# Altium schematic sheet STM32.SchDoc
size A4; SheetNumber: 2; SheetTotal: 3
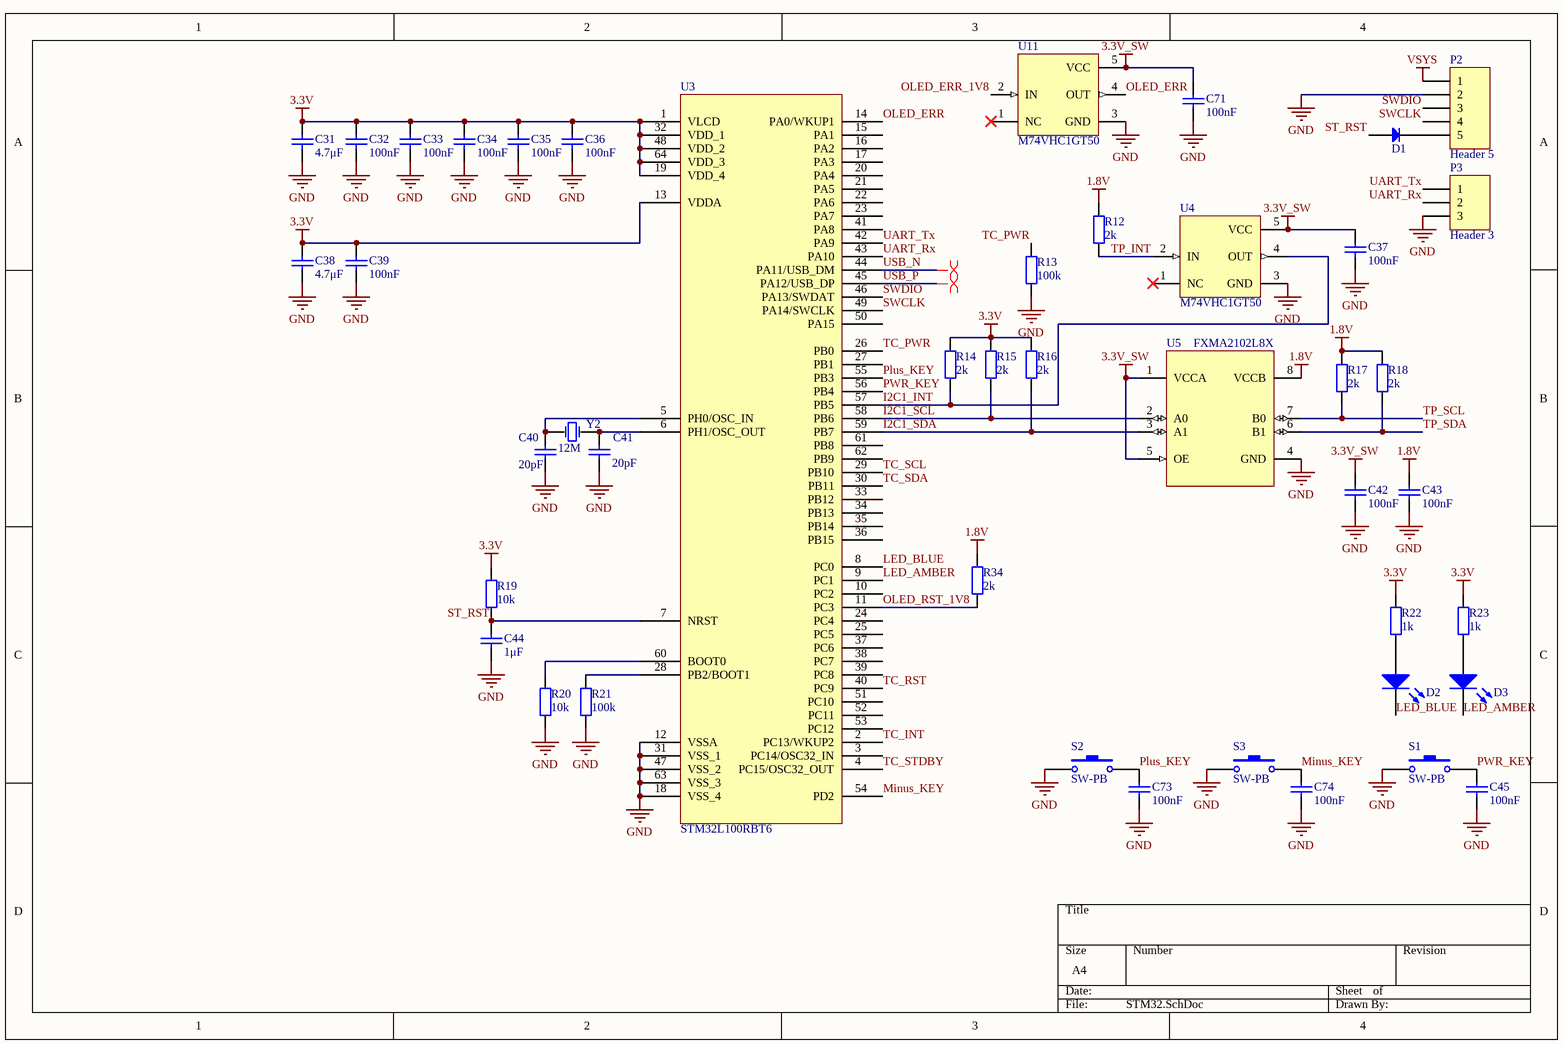
[diagram p0: STM32.SchDoc]

## Parts
C31  value 4.7μF  [0402C]  (hidden comment: Cap)
C32  value 100nF  [0402C]  (hidden comment: Cap)
C33  value 100nF  [0402C]  (hidden comment: Cap)
C34  value 100nF  [0402C]  (hidden comment: Cap)
C35  value 100nF  [0402C]  (hidden comment: Cap)
C36  value 100nF  [0402C]  (hidden comment: Cap)
C37  value 100nF  [0402C]  (hidden comment: Cap)
C38  value 4.7μF  [0402C]  (hidden comment: Cap)
C39  value 100nF  [0402C]  (hidden comment: Cap)
C40  value 20pF  [0402C]  (hidden comment: Cap)
C41  value 20pF  [0402C]  (hidden comment: Cap)
C42  value 100nF  [0402C]  (hidden comment: Cap)
C43  value 100nF  [0402C]  (hidden comment: Cap)
C44  value 1μF  [0402C]  (hidden comment: Cap)
C45  value 100nF  [0402C]  (hidden comment: Cap)
C71  value 100nF  [0402C]  (hidden comment: Cap)
C73  value 100nF  [0402C]  (hidden comment: Cap)
C74  value 100nF  [0402C]  (hidden comment: Cap)
D1  Diode  [SOD-323]  (value not drawn)
D2  LED0  [0603LED]  (value not drawn)
D3  LED0  [0603LED]  (value not drawn)
P2  Header 5  [HDR1X5]
P3  Header 3  [HDR1X3]
R12  value 2k  [0402R]  (hidden comment: Resistor)
R13  value 100k  [0402R]  (hidden comment: Resistor)
R14  value 2k  [0402R]  (hidden comment: Resistor)
R15  value 2k  [0402R]  (hidden comment: Resistor)
R16  value 2k  [0402R]  (hidden comment: Resistor)
R17  value 2k  [0402R]  (hidden comment: Resistor)
R18  value 2k  [0402R]  (hidden comment: Resistor)
R19  value 10k  [0402R]  (hidden comment: Resistor)
R20  value 10k  [0402R]  (hidden comment: Resistor)
R21  value 100k  [0402R]  (hidden comment: Resistor)
R22  value 1k  [0402R]  (hidden comment: Resistor)
R23  value 1k  [0402R]  (hidden comment: Resistor)
R34  value 2k  [0402R]  (hidden comment: Resistor)
S1  SW-PB  [SW-TS-TL3330E]
S2  SW-PB  [SW-TS-TL3330E]
S3  SW-PB  [SW-TS-TL3330E]
U3  STM32L100RBT6  [LQFP-64]
U4  M74VHC1GT50  [SC-70(SC-70-5)]
U5  FXMA2102L8X  [QFN-8_L1.6_W1.6]
U11  M74VHC1GT50  [SC-70(SC-70-5)]
Y2  value 12M  [XTAL_HC-49USX]  (hidden comment: XTAL)

## Nets
1.8V: C43.2 R12.1 R17.1 R18.1 R34.1 U5.8(VCCB)
3.3V: C31.2 C32.2 C33.2 C34.2 C35.2 C36.2 C38.2 C39.2 R14.1 R15.1 R16.1 R19.1 R22.1 R23.1 U3.1(VLCD) U3.13(VDDA) U3.19(VDD_4) U3.32(VDD_1) U3.48(VDD_2) U3.64(VDD_3)
3.3V_SW: C37.2 C42.2 C71.2 U4.5(VCC) U5.1(VCCA) U5.5(OE) U11.5(VCC)
GND: C31.1 C32.1 C33.1 C34.1 C35.1 C36.1 C37.1 C38.1 C39.1 C40.1 C41.1 C42.1 C43.1 C44.1 C45.1 C71.1 C73.1 C74.1 P2.2 P3.3 R13.2 R20.2 R21.2 S1.1 S2.1 S3.1 U3.12(VSSA) U3.18(VSS_4) U3.31(VSS_1) U3.47(VSS_2) U3.63(VSS_3) U4.3(GND) U5.4(GND) U11.3(GND)
VSYS: P2.1
I2C1_INT: R14.2 U3.57(PB5) U4.4(OUT)
I2C1_SCL: R15.2 U3.58(PB6) U5.2(A0)
I2C1_SDA: R16.2 U3.59(PB7) U5.3(A1)
LED_AMBER: D3.2(K) U3.9(PC1)
LED_BLUE: D2.2(K) U3.8(PC0)
Minus_KEY: C74.2 S3.2 U3.54(PD2)
OLED_ERR: U3.14(PA0/WKUP1) U11.4(OUT)
OLED_ERR_1V8: U11.2(IN)
OLED_RST_1V8: R34.2 U3.11(PC3)
Plus_KEY: C73.2 S2.2 U3.55(PB3)
PWR_KEY: C45.2 S1.2 U3.56(PB4)
ST_RST: C44.2 D1.1(A) R19.2 U3.7(NRST)
SWCLK: P2.4 U3.49(PA14/SWCLK)
SWDIO: P2.3 U3.46(PA13/SWDAT)
TC_INT: U3.2(PC13/WKUP2)
TC_PWR: R13.1 U3.26(PB0)
TC_RST: U3.40(PC9)
TC_SCL: U3.29(PB10)
TC_SDA: U3.30(PB11)
TC_STDBY: U3.4(PC15/OSC32_OUT)
TP_INT: R12.2 U4.2(IN)
TP_SCL: R17.2 U5.7(B0)
TP_SDA: R18.2 U5.6(B1)
UART_Rx: P3.2 U3.43(PA10)
UART_Tx: P3.1 U3.42(PA9)
USB_N: U3.44(PA11/USB_DM)
USB_P: U3.45(PA12/USB_DP)
NetC40_2: C40.2 U3.5(PH0/OSC_IN) Y2.2(OSC2)
NetC41_2: C41.2 U3.6(PH1/OSC_OUT) Y2.1(OSC1)
NetD1_2: D1.2(K) P2.5
NetD2_1: D2.1(A) R22.2
NetD3_1: D3.1(A) R23.2
NetR20_1: R20.1 U3.60(BOOT0)
NetR21_1: R21.1 U3.28(PB2/BOOT1)

Not connected (* = marked no-connect by the designer): U3 3(PC14/OSC32_IN) 10(PC2) 15(PA1) 16(PA2) 17(PA3) 20(PA4) 21(PA5) 22(PA6) 23(PA7) 24(PC4) 25(PC5) 27(PB1) 33(PB12) 34(PB13) 35(PB14) 36(PB15) 37(PC6) 38(PC7) 39(PC8) 41(PA8) 50(PA15) 51(PC10) 52(PC11) 53(PC12) 61(PB8) 62(PB9); U4 1(NC)*; U11 1(NC)*

## Layout directives
differential pair: USB_N, USB_P

## Library data of the parts
C31-C45 C71 C73 C74 = Cap: 无极性电容; Published: 8-Jun-2000; LatestRevisionDate: 17-Jul-2002; LatestRevisionNote: Re-released for DXP Platform.; PackageReference: RAD-0.3; Publisher: Altium Limited
D1 = Diode: 二极管; Type: 1N4001; Published: 8-Jun-2000; LatestRevisionDate: 17-Jul-2002; LatestRevisionNote: Re-released for DXP Platform.; PackageDocument: Sep-1996; PackageReference: SMC; Publisher: Altium Limited; Code_JEDEC: DO-214-AB
D2 D3 = LED0: 发光二极管; Published: 8-Jun-2000; LatestRevisionDate: 08-Jul-2005; LatestRevisionNote: Mech Layer 1 removed.; PackageReference: LED-0; Publisher: Altium Limited
P2 = Header 5: Header, 5-Pin; LatestRevisionDate: 17-Jul-2002; LatestRevisionNote: Re-released for DXP Platform.; Publisher: Altium Limited
P3 = Header 3: Header, 3-Pin; LatestRevisionDate: 17-Jul-2002; LatestRevisionNote: Re-released for DXP Platform.; Publisher: Altium Limited
R12-R23 R34 = Resistor: 电阻; Published: 8-Jun-2000; LatestRevisionDate: 17-Jul-2002; LatestRevisionNote: Re-released for DXP Platform.; PackageReference: AXIAL-0.4; Publisher: Altium Limited
S1-S3 = SW-PB: 微动开关; Published: 24-Mar-1999; LatestRevisionDate: 17-Jul-2002; LatestRevisionNote: Re-released for DXP Platform.; PackageReference: SPST-2; Publisher: Altium Limited
U3 = STM32L100RBT6: IC, STM32L MICROCONTROLLER, ARM CORTEX M3; Manufacturer: ST MICROELECTRONICS; Part Number: STM32L100RBT6; Verified Pinout: *
U4 U11 = M74VHC1GT50DFT2G: IC, NON-INVERTING BUFFER, CMOS LOGIC LEVEL SHIFTER; Manufacturer: ON SEMICONDUCTOR; Part Number: M74VHC1GT50DFT2G; Pinout verified: *
U5 = FXMA2102L8X: IC, I2C TRANSLATOR, BUFFER AND REPEATER; Manufacturer: FAIRCHILD SEMICONDUCTOR; Part Number: FXMA2102L8X; Verified Pinout: *
Y2 = XTAL-2P: 晶振; Published: 8-Jun-2000; LatestRevisionDate: 17-Jul-2002; LatestRevisionNote: Re-released for DXP Platform.; PackageReference: R38; Publisher: Altium Limited